# EAGLE design Looping Louie Motherboard (EAGLE 7.2.0)
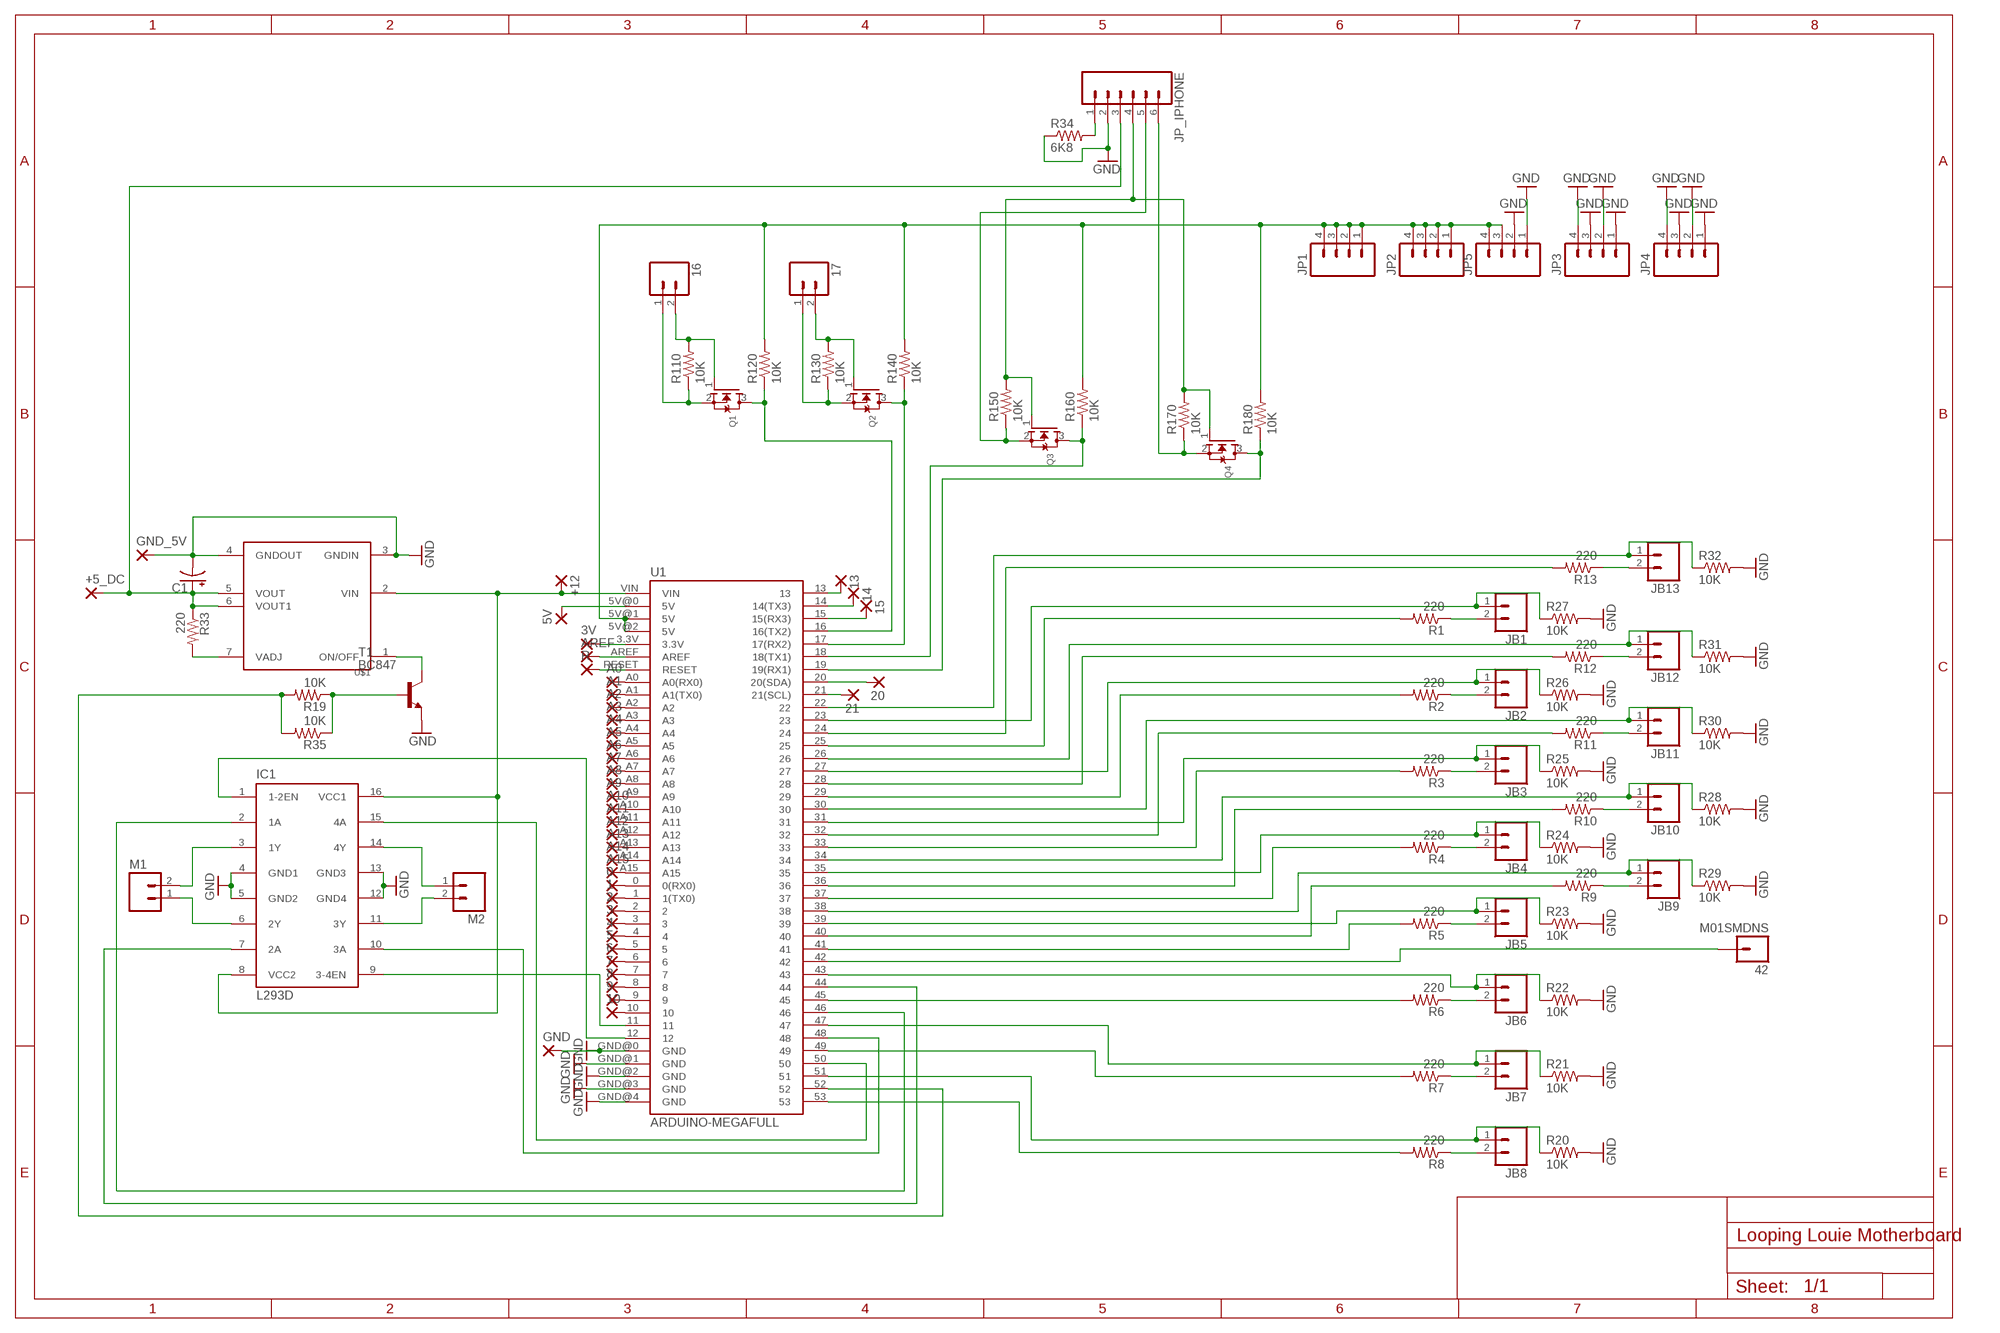
[diagram p0: schematic, sheet 1]

## Parts
0  1,6/0,8  [1,6/0,8]
1  1,6/0,8  [1,6/0,8]
2  1,6/0,8  [1,6/0,8]
3  1,6/0,8  [1,6/0,8]
3V  1,6/0,8  [1,6/0,8]
4  1,6/0,8  [1,6/0,8]
5  1,6/0,8  [1,6/0,8]
5V  1,6/0,8  [1,6/0,8]
6  1,6/0,8  [1,6/0,8]
7  1,6/0,8  [1,6/0,8]
8  1,6/0,8  [1,6/0,8]
9  1,6/0,8  [1,6/0,8]
10  1,6/0,8  [1,6/0,8]
13  1,6/0,8  [1,6/0,8]
14  1,6/0,8  [1,6/0,8]
15  1,6/0,8  [1,6/0,8]
16  M021X02_NO_SILK  [1X02_NO_SILK]
17  M021X02_NO_SILK  [1X02_NO_SILK]
20  1,6/0,8  [1,6/0,8]
21  1,6/0,8  [1,6/0,8]
42  M01SMDNS  [1X01NS]
+5_DC  3,81/1,4  [3,81/1,4]
+12  3,81/1,4  [3,81/1,4]
A0  1,6/0,8  [1,6/0,8]
A1  1,6/0,8  [1,6/0,8]
A2  1,6/0,8  [1,6/0,8]
A3  1,6/0,8  [1,6/0,8]
A4  1,6/0,8  [1,6/0,8]
A5  1,6/0,8  [1,6/0,8]
A6  1,6/0,8  [1,6/0,8]
A7  1,6/0,8  [1,6/0,8]
A8  1,6/0,8  [1,6/0,8]
A9  1,6/0,8  [1,6/0,8]
A10  1,6/0,8  [1,6/0,8]
A11  1,6/0,8  [1,6/0,8]
A12  1,6/0,8  [1,6/0,8]
A13  1,6/0,8  [1,6/0,8]
A14  1,6/0,8  [1,6/0,8]
A15  1,6/0,8  [1,6/0,8]
AREF  1,6/0,8  [1,6/0,8]
C1  CAP_POLG  [PANASONIC_G]
GND  3,81/1,4  [3,81/1,4]
GND_5V  3,81/1,4  [3,81/1,4]
IC1  L293D  [DIL16]
JB1  M021X02_NO_SILK  [1X02_NO_SILK]
JB2  M021X02_NO_SILK  [1X02_NO_SILK]
JB3  M021X02_NO_SILK  [1X02_NO_SILK]
JB4  M021X02_NO_SILK  [1X02_NO_SILK]
JB5  M021X02_NO_SILK  [1X02_NO_SILK]
JB6  M021X02_NO_SILK  [1X02_NO_SILK]
JB7  M021X02_NO_SILK  [1X02_NO_SILK]
JB8  M021X02_NO_SILK  [1X02_NO_SILK]
JB9  M021X02_NO_SILK  [1X02_NO_SILK]
JB10  M021X02_NO_SILK  [1X02_NO_SILK]
JB11  M021X02_NO_SILK  [1X02_NO_SILK]
JB12  M021X02_NO_SILK  [1X02_NO_SILK]
JB13  M021X02_NO_SILK  [1X02_NO_SILK]
JP1  M041X04_NO_SILK  [1X04_NO_SILK]
JP2  M041X04_NO_SILK  [1X04_NO_SILK]
JP3  M041X04_NO_SILK  [1X04_NO_SILK]
JP4  M041X04_NO_SILK  [1X04_NO_SILK]
JP5  M041X04_NO_SILK  [1X04_NO_SILK]
JP_IPHONE  M06LONGPADS  [1X06_LONGPADS]
M1  M02PTH3  [1X02_LONGPADS]
M2  M02PTH3  [1X02_LONGPADS]
Q1  MOSFET-NWAVE  [SOT23-W]
Q2  MOSFET-NWAVE  [SOT23-W]
Q3  MOSFET-NWAVE  [SOT23-W]
Q4  MOSFET-NWAVE  [SOT23-W]
R  1,6/0,8  [1,6/0,8]
R1  220  RESISTOR0603-RES  [0603-RES]
R2  220  RESISTOR0603-RES  [0603-RES]
R3  220  RESISTOR0603-RES  [0603-RES]
R4  220  RESISTOR0603-RES  [0603-RES]
R5  220  RESISTOR0603-RES  [0603-RES]
R6  220  RESISTOR0603-RES  [0603-RES]
R7  220  RESISTOR0603-RES  [0603-RES]
R8  220  RESISTOR0603-RES  [0603-RES]
R9  220  RESISTOR0603-RES  [0603-RES]
R10  220  RESISTOR0603-RES  [0603-RES]
R11  220  RESISTOR0603-RES  [0603-RES]
R12  220  RESISTOR0603-RES  [0603-RES]
R13  220  RESISTOR0603-RES  [0603-RES]
R19  10K  RESISTOR0603-RES  [0603-RES]
R20  10K  RESISTOR0603-RES  [0603-RES]
R21  10K  RESISTOR0603-RES  [0603-RES]
R22  10K  RESISTOR0603-RES  [0603-RES]
R23  10K  RESISTOR0603-RES  [0603-RES]
R24  10K  RESISTOR0603-RES  [0603-RES]
R25  10K  RESISTOR0603-RES  [0603-RES]
R26  10K  RESISTOR0603-RES  [0603-RES]
R27  10K  RESISTOR0603-RES  [0603-RES]
R28  10K  RESISTOR0603-RES  [0603-RES]
R29  10K  RESISTOR0603-RES  [0603-RES]
R30  10K  RESISTOR0603-RES  [0603-RES]
R31  10K  RESISTOR0603-RES  [0603-RES]
R32  10K  RESISTOR0603-RES  [0603-RES]
R33  220  RESISTOR0603-RES  [0603-RES]
R34  6K8  RESISTOR0603-RES  [0603-RES]
R35  10K  RESISTOR0603-RES  [0603-RES]
R110  10K  RESISTOR0603-RES  [0603-RES]
R120  10K  RESISTOR0603-RES  [0603-RES]
R130  10K  RESISTOR0603-RES  [0603-RES]
R140  10K  RESISTOR0603-RES  [0603-RES]
R150  10K  RESISTOR0603-RES  [0603-RES]
R160  10K  RESISTOR0603-RES  [0603-RES]
R170  10K  RESISTOR0603-RES  [0603-RES]
R180  10K  RESISTOR0603-RES  [0603-RES]
T1  BC847  [SOT23]
U1  ARDUINO-MEGAFULL  [ARDUINO_MEGA_MIRROR]
U$1  KIS-3R33S  [KIS-3R33S]

## Nets
3V3_IPHONE: JP_IPHONE.4 Q3.1(G) Q4.1(G) R150.2 R170.2
5V: JP1.1 JP1.2 JP1.3 JP1.4 JP2.1 JP2.2 JP2.3 JP2.4 JP5.3 JP5.4 R120.2 R140.2 R160.2 R180.2 U1.5V@1(5V) U1.5V@2(5V)
12V: +12.1(P) IC1.8(VCC2) IC1.16(VCC1) U1.VIN U$1.2(VIN)
+5V_DC: +5_DC.1(P) C1.+ JP_IPHONE.3 R33.1 U$1.5(VOUT) U$1.6(VOUT1)
GND: C1.- GND.1(P) GND_5V.1(P) IC1.4(GND1) IC1.5(GND2) IC1.12(GND4) IC1.13(GND3) JP3.1 JP3.2 JP3.3 JP3.4 JP4.1 JP4.2 JP4.3 JP4.4 JP5.1 JP5.2 JP_IPHONE.2 R20.2 R21.2 R22.2 R23.2 R24.2 R25.2 R26.2 R27.2 R28.2 R29.2 R30.2 R31.2 R32.2 R34.1 T1.2(E) U1.GND@0(GND) U1.GND@1(GND) U1.GND@2(GND) U1.GND@3(GND) U1.GND@4(GND) U$1.3(GNDIN) U$1.4(GNDOUT)
N$1: JB1.1 R27.1 U1.23
N$2: R1.2 U1.25
N$3: JB2.1 R26.1 U1.27
N$4: R2.2 U1.29
N$5: JB3.1 R25.1 U1.31
N$6: R3.2 U1.33
N$7: JB1.2 R1.1
N$8: JB2.2 R2.1
N$9: JB3.2 R3.1
N$10: R5.2 U1.41
N$11: JB4.1 R24.1 U1.35
N$12: JB5.1 R23.1 U1.39
N$13: JB4.2 R4.1
N$14: JB5.2 R5.1
N$15: JB6.2 R6.1
N$16: JB7.2 R7.1
N$17: JB8.2 R8.1
N$18: JB9.2 R9.1
N$19: JB10.2 R10.1
N$20: R8.2 U1.53
N$21: IC1.10(3A) U1.48
N$22: R6.2 U1.45
N$23: IC1.7(2A) U1.44
N$24: IC1.15(4A) U1.50
N$25: R7.2 U1.49
N$26: JB7.1 R21.1 U1.47
N$27: R4.2 U1.37
N$28: JB8.1 R20.1 U1.51
N$30: IC1.2(1A) U1.46
N$31: IC1.1(1-2EN) U1.12
N$32: Q4.3(D) R180.1 U1.19(19(RX1))
N$34: IC1.9(3-4EN) U1.11
N$36: JP_IPHONE.1 R34.2
N$37: 17.1 Q2.2(S) R130.1
N$38: Q2.3(D) R140.1 U1.17(17(RX2))
N$39: 17.2 Q2.1(G) R130.2
N$41: Q1.3(D) R120.1 U1.16(16(TX2))
N$42: 16.2 Q1.1(G) R110.2
N$43: R19.2 R35.2 U1.52
N$48: JB10.1 R28.1 U1.34
N$49: R11.2 U1.32
N$50: JB11.1 R30.1 U1.30
N$51: R12.2 U1.28
N$52: JB12.1 R31.1 U1.26
N$53: R13.2 U1.24
N$54: JB13.1 R32.1 U1.22
N$55: R19.1 R35.1 T1.1(B)
N$56: 16.1 Q1.2(S) R110.1
N$57: JB6.1 R22.1 U1.43
N$62: 5V.1(P) U1.5V@0(5V)
N$63: IC1.14(4Y) M2.1
N$64: IC1.11(3Y) M2.2
N$65: IC1.6(2Y) M1.1
N$66: IC1.3(1Y) M1.2
N$69: T1.3(C) U$1.1(ON/OFF)
N$72: R33.2 U$1.7(VADJ)
N$73: 0.1(P) U1.0(0(RX0))
N$74: 1.1(P) U1.1(1(TX0))
N$75: 2.1(P) U1.2
N$76: 3.1(P) U1.3
N$77: 4.1(P) U1.4
N$78: 5.1(P) U1.5
N$79: 6.1(P) U1.6
N$80: 7.1(P) U1.7
N$81: 8.1(P) U1.8
N$82: 9.1(P) U1.9
N$83: 10.1(P) U1.10
N$84: 3V.1(P) U1.3.3V
N$85: AREF.1(P) U1.AREF
N$86: R.1(P) U1.RESET
N$87: A0.1(P) U1.A0(A0(RX0))
N$88: A1.1(P) U1.A1(A1(TX0))
N$89: A2.1(P) U1.A2
N$90: A3.1(P) U1.A3
N$91: A4.1(P) U1.A4
N$92: A5.1(P) U1.A5
N$93: A6.1(P) U1.A6
N$94: A7.1(P) U1.A7
N$95: A8.1(P) U1.A8
N$96: A9.1(P) U1.A9
N$97: A10.1(P) U1.A10
N$98: A11.1(P) U1.A11
N$99: A12.1(P) U1.A12
N$100: A13.1(P) U1.A13
N$101: A14.1(P) U1.A14
N$102: A15.1(P) U1.A15
N$103: 13.1(P) U1.13
N$104: 14.1(P) U1.14(14(TX3))
N$105: 15.1(P) U1.15(15(RX3))
N$106: 20.1(P) U1.20(20(SDA))
N$107: 21.1(P) U1.21(21(SCL))
N$109: Q3.3(D) R160.1 U1.18(18(TX1))
N$111: R10.2 U1.36
N$117: JB9.1 R29.1 U1.38
N$118: R9.2 U1.40
N$119: 42.1 U1.42
N$122: JB13.2 R13.1
N$123: JB12.2 R12.1
N$124: JB11.2 R11.1
RX_IPHONE: JP_IPHONE.6 Q4.2(S) R170.1
TX_IPHONE: JP_IPHONE.5 Q3.2(S) R150.1

## Library data of the parts
0 1-3 3V 4 5 5V 6-10 13-15 20 21 A0 A1-A15 AREF R = wirepad:1,6/0,8: THROUGH-HOLE PAD
16 17 JB1-JB13 M1 M2 = SparkFun:M02: Header 2 Standard 2-pin 0.1" header. Use with straight break away headers (SKU : PRT-00116), right angle break away headers (PRT-00553), swiss pins (PRT-00743), machine pins (PRT-00117), and female headers (PRT-00115). Molex polarized connector foot print use with SKU : PRT-08233 with associated crimp pins and housings.
42 = SparkFun:M01: Header 1 Standard 1-pin 0.1" header. Use with straight break away headers (SKU : PRT-00116), right angle break away headers (PRT-00553), swiss pins (PRT-00743), machine pins (PRT-00117), and female headers (PRT-00115).
+5_DC +12 GND GND_5V = wirepad:3,81/1,4: THROUGH-HOLE PAD
C1 = SparkFun:CAP_POL: Capacitor Polarized These are standard SMD and PTH capacitors. Normally 10uF, 47uF, and 100uF in electrolytic and tantalum varieties. Always verify the external diameter of the through hole cap, it varies with capacity, voltage, and manufacturer. The EIA devices should be standard.
IC1 = st-microelectronics:L293D: PUSH-PULL 4 CHANNEL DRIVER; MPN: L293D; OC_FARNELL: 9589619; OC_NEWARK: 56P8249
JP1-JP5 = SparkFun:M04: Header 4 Standard 4-pin 0.1" header. Use with straight break away headers (SKU : PRT-00116), right angle break away headers (PRT-00553), swiss pins (PRT-00743), machine pins (PRT-00117), and female headers (PRT-00115). Molex polarized connector foot print use with SKU : PRT-08231 with associated crimp pins and housings. 1MM SMD Version SKU: PRT-10208
JP_IPHONE = SparkFun:M06: Header 6 Standard 6-pin 0.1" header. Use with straight break away headers (SKU : PRT-00116), right angle break away headers (PRT-00553), swiss pins (PRT-00743), machine pins (PRT-00117), and female headers (PRT-00115). Molex polarized connector foot print use with SKU : PRT-08094 with associated crimp pins and housings. NOTES ON THE VARIANTS LOCK and LOCK_LONGPADS... This footprint was designed to help hold the alignment of a through-hole component (i.e. 6-pin header) while soldering it into place. You may notice that each hole has been shifted either up or down by 0.005 of an inch from it's more standard position (which is a perfectly straight line). This slight alteration caused the pins (the squares in the middle) to touch the edges of the holes. Because they are alternating, it causes a "brace" to hold the component in place. 0.005 has proven to be the perfect amount of "off-center" position when using our standard breakaway headers. Although looks a little odd when you look at the bare footprint, once you have a header in there, the alteration is very hard to notice. Also, if you push a header all the way into place, it is covered up entirely on the bottom side. This idea of altering the position of holes to aid alignment will be further integrated into the Sparkfun Library for other footprints. It can help hold any component with 3 or more connection pins.
Q1-Q4 = adafruit:MOSFET-N: N-Channel Mosfet 2N7002E - 60V 260mA SOT23 [Digikey: 2N7002ET1GOSTR-ND] - REEL BSH103 - 30V 850mA SOT23 [Digikey: 568-5013-1-ND]
R1-R13 R19-R35 R110 R120 R130 R140 R150 R160 R170 R180 = SparkFun:RESISTOR: Resistor Basic schematic elements and footprints for 0603, 1206, and PTH resistors.
T1 = transistor:BC847: NPN TRANSISTOR
U1 = Arduino Mega mirror:ARDUINO-MEGA: Arduino Mega footprint connections
U$1 = Kis3r33s:KIS-3R33S: DC-DC Converter

## Board
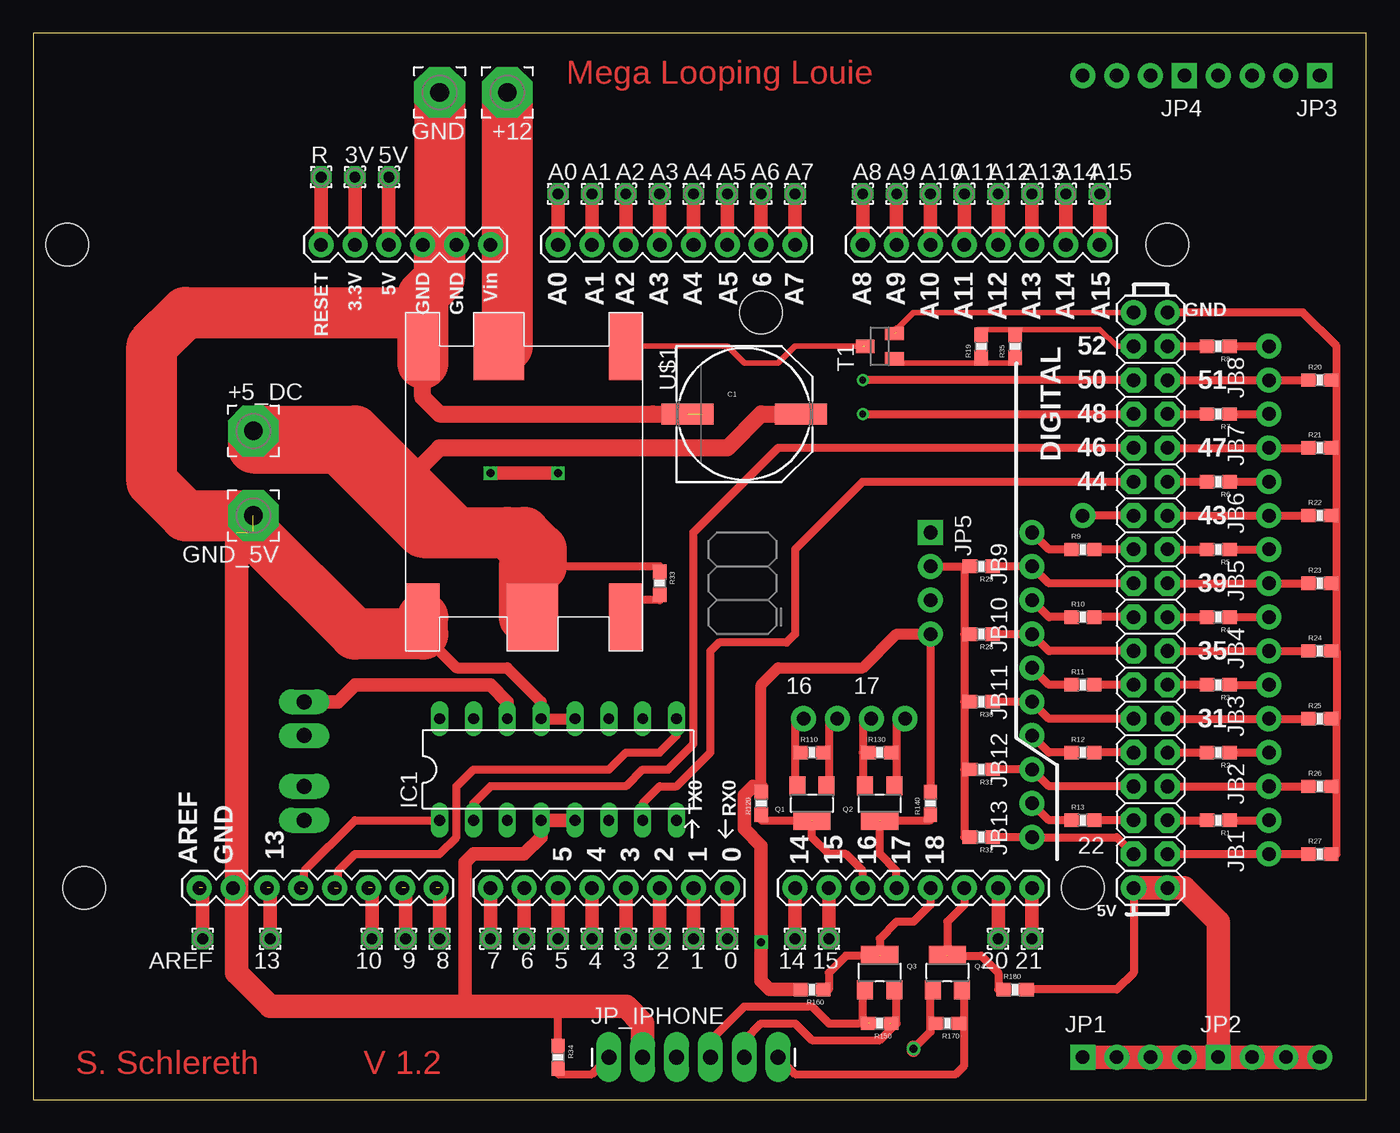
[diagram p1: board, top side]
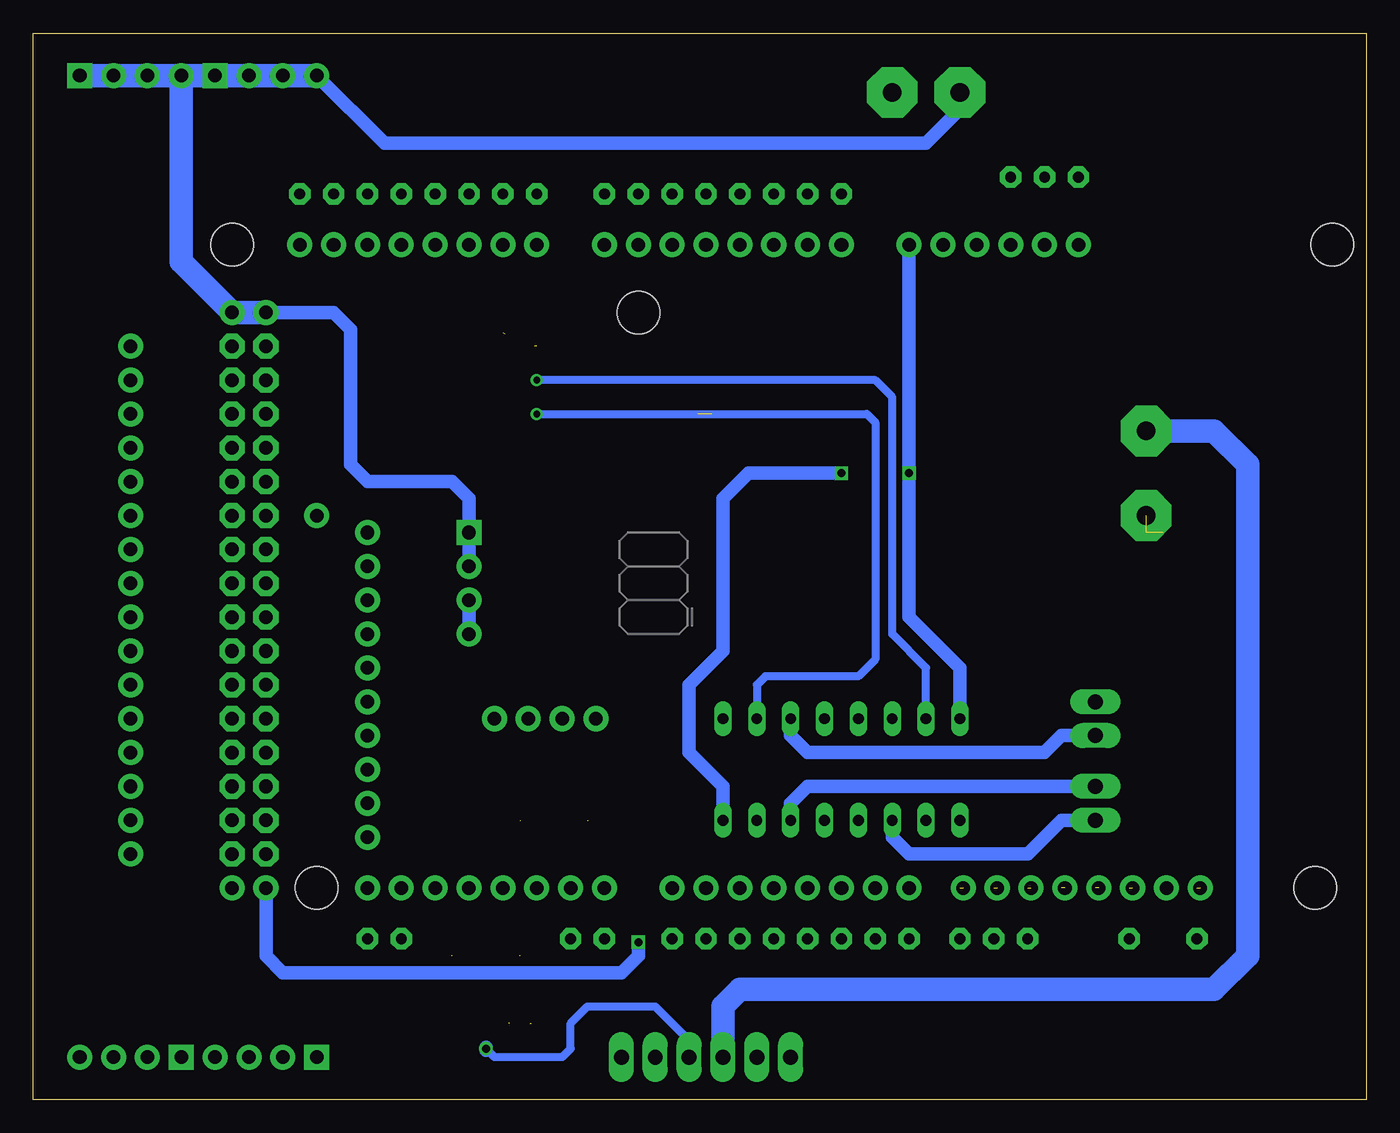
[diagram p2: board, bottom side, seen from below]

Size 100 x 80 mm. Coordinates in mm from the lower left corner, seen from the top.
Outline: 0,0 100,0 100,80 0,80 0,0
Copper layers (1*16): Top 0.035mm / dielectric 1.5mm / Bottom 0.035mm
Design rules "default *": minimum track width 10mil, minimum drill 24mil, track to track 8mil, track to pad 8mil, pad to pad 8mil, via to via 8mil, smd to smd 8mil, copper to edge 40mil, drill to drill 6mil, minimum pad ring 10mil, minimum via ring 8mil, stop-mask expansion 4mil, vias tented up to drill 0mil, thermal gap 10mil

### Footprints (pad centres in the part's own frame; a part is rotated, then mirrored left to right if it is on the bottom)
1,6/0,8 = drill 0.813 pad 1.6 octagon: 1 0,0
1X02_NO_SILK = drill 1.016 pad 1.88: 1 0,0; 2 2.54,0
1X01NS = drill 1.016 pad 1.88: 1 0,0
3,81/1,4 = drill 1.397 pad 3.81 octagon: 1 0,0
PANASONIC_G = smd 3.9 x 1.6: + 4.25,0; - -4.25,0
DIL16 = drill 0.813 long: 1 -8.89,-3.81; 2 -6.35,-3.81; 3 -3.81,-3.81; 4 -1.27,-3.81; 5 1.27,-3.81; 6 3.81,-3.81; 7 6.35,-3.81; 8 8.89,-3.81; 9 8.89,3.81; 10 6.35,3.81; 11 3.81,3.81; 12 1.27,3.81; 13 -1.27,3.81; 14 -3.81,3.81; 15 -6.35,3.81; 16 -8.89,3.81
1X04_NO_SILK = drill 1.016 pad 1.88 square: 1 0,0 | drill 1.016 pad 1.88: 2 2.54,0; 3 5.08,0; 4 7.62,0
1X06_LONGPADS = drill 1.118 pad 1.88 long: 1 0,0; 2 2.54,0; 3 5.08,0; 4 7.62,0; 5 10.16,0; 6 12.7,0
1X02_LONGPADS = drill 1.118 pad 1.88 long: 1 0,0; 2 2.54,0
SOT23-W = smd 1.2 x 1.4: 1 -1.1,-1.3; 2 1.1,-1.3 | smd 2.8 x 1.4: 3 0,1.3
0603-RES = smd 1.1 x 1: 1 -0.85,0; 2 0.85,0
SOT23 = smd 1 x 1.4: 1 -0.95,-1.1; 2 0.95,-1.1; 3 0,1.1
ARDUINO_MEGA_MIRROR = drill 1.016 pad 1.88: 0 -63.5,50.8; 1 -60.96,50.8; 2 -58.42,50.8; 3 -55.88,50.8; 3.3V -35.56,2.54; 4 -53.34,50.8; 5 -50.8,50.8; 5V@0 -38.1,2.54; 5V@1 -93.98,50.8; 5V@2 -96.52,50.8; 6 -48.26,50.8; 7 -45.72,50.8; 8 -41.656,50.8; 9 -39.116,50.8; 10 -36.576,50.8; 11 -34.036,50.8; 12 -31.496,50.8; 13 -28.956,50.8; 14 -68.58,50.8; 15 -71.12,50.8; 16 -73.66,50.8; 17 -76.2,50.8; 18 -78.74,50.8; 19 -81.28,50.8; 20 -83.82,50.8; 21 -86.36,50.8; A0 -50.8,2.54; A1 -53.34,2.54; A2 -55.88,2.54; A3 -58.42,2.54; A4 -60.96,2.54; A5 -63.5,2.54; A6 -66.04,2.54; A7 -68.58,2.54; A8 -73.66,2.54; A9 -76.2,2.54; A10 -78.74,2.54; A11 -81.28,2.54; A12 -83.82,2.54; A13 -86.36,2.54; A14 -88.9,2.54; A15 -91.44,2.54; AREF -23.876,50.8; GND@0 -40.64,2.54; GND@1 -43.18,2.54; GND@2 -93.98,7.62; GND@3 -96.52,7.62; GND@4 -26.416,50.8; RESET -33.02,2.54; VIN -45.72,2.54 | drill 1.016 pad 1.88 octagon: 22 -93.98,48.26; 23 -96.52,48.26; 24 -93.98,45.72; 25 -96.52,45.72; 26 -93.98,43.18; 27 -96.52,43.18; 28 -93.98,40.64; 29 -96.52,40.64; 30 -93.98,38.1; 31 -96.52,38.1; 32 -93.98,35.56; 33 -96.52,35.56; 34 -93.98,33.02; 35 -96.52,33.02; 36 -93.98,30.48; 37 -96.52,30.48; 38 -93.98,27.94; 39 -96.52,27.94; 40 -93.98,25.4; 41 -96.52,25.4; 42 -93.98,22.86; 43 -96.52,22.86; 44 -93.98,20.32; 45 -96.52,20.32; 46 -93.98,17.78; 47 -96.52,17.78; 48 -93.98,15.24; 49 -96.52,15.24; 50 -93.98,12.7; 51 -96.52,12.7; 52 -93.98,10.16; 53 -96.52,10.16 | hole 3.2: -15.24,50.8; -13.97,2.54; -66.04,7.62; -90.17,50.8; -96.52,2.54
KIS-3R33S = smd 5.08 x 2.54: 1 -10.16,7.62; 3 -10.16,-7.62; 4 10.16,-7.62; 5 10.16,0; 6 10.16,1.27; 7 10.16,7.62 | smd 5.08 x 3.81: 2 -10.16,-1.905

### Placement (x,y rotation side)
0  52.07,12.06 180 top
1  49.53,12.06 180 top
2  46.99,12.06 180 top
3  44.45,12.06 180 top
3V  24.13,69.22 0 top
4  41.91,12.06 180 top
5  39.37,12.06 180 top
5V  26.67,69.22 0 top
6  36.83,12.06 180 top
7  34.29,12.06 180 top
8  30.48,12.06 180 top
9  27.94,12.06 180 top
10  25.4,12.06 180 top
13  17.78,12.06 180 top
14  57.15,12.06 180 top
15  59.69,12.06 180 top
16  57.78,28.58 0 top
17  62.87,28.58 0 top
20  72.39,12.06 180 top
21  74.93,12.06 180 top
42  78.74,43.81 0 top
+5_DC  16.51,50.16 0 top
+12  35.56,75.57 180 top
A0  39.37,67.95 0 top
A1  41.91,67.95 0 top
A2  44.45,67.95 0 top
A3  46.99,67.95 0 top
A4  49.53,67.95 0 top
A5  52.07,67.95 0 top
A6  54.61,67.95 0 top
A7  57.15,67.95 0 top
A8  62.23,67.95 0 top
A9  64.77,67.95 0 top
A10  67.31,67.95 0 top
A11  69.85,67.95 0 top
A12  72.39,67.95 0 top
A13  74.93,67.95 0 top
A14  77.47,67.95 0 top
A15  80.01,67.95 0 top
AREF  12.7,12.06 180 top
C1  53.34,51.43 0 top
GND  30.48,75.57 180 top
GND_5V  16.51,43.81 180 top
IC1  39.37,24.77 0 top
JB1  92.71,18.42 90 top
JB2  92.71,23.5 90 top
JB3  92.71,28.58 90 top
JB4  92.71,33.66 90 top
JB5  92.71,38.73 90 top
JB6  92.71,43.81 90 top
JB7  92.71,48.89 90 top
JB8  92.71,53.98 90 top
JB9  74.93,40 90 top
JB10  74.93,34.92 90 top
JB11  74.93,29.85 90 top
JB12  74.93,24.77 90 top
JB13  74.93,19.69 90 top
JP1  78.74,3.17 0 top
JP2  88.9,3.17 0 top
JP3  96.52,76.84 180 top
JP4  86.36,76.84 180 top
JP5  67.31,42.54 270 top
JP_IPHONE  43.18,3.17 0 top
M1  20.32,23.5 270 top
M2  20.32,29.85 270 top
Q1  58.42,22.23 180 top
Q2  63.5,22.23 180 top
Q3  63.5,9.53 0 top
Q4  68.58,9.53 0 top
R  21.59,69.22 0 top
R1  88.9,20.96 180 top
R2  88.9,26.04 180 top
R3  88.9,31.12 180 top
R4  88.9,36.2 180 top
R5  88.9,41.27 180 top
R6  88.9,46.35 180 top
R7  88.9,51.43 180 top
R8  88.9,56.52 180 top
R9  78.74,41.27 0 top
R10  78.74,36.2 0 top
R11  78.74,31.12 0 top
R12  78.74,26.04 0 top
R13  78.74,20.96 0 top
R19  71.12,56.52 90 top
R20  96.52,53.98 0 top
R21  96.52,48.89 0 top
R22  96.52,43.81 0 top
R23  96.52,38.73 0 top
R24  96.52,33.66 0 top
R25  96.52,28.58 0 top
R26  96.52,23.5 0 top
R27  96.52,18.42 0 top
R28  71.12,34.92 180 top
R29  71.12,40 180 top
R30  71.12,29.85 180 top
R31  71.12,24.77 180 top
R32  71.12,19.69 180 top
R33  46.99,38.73 270 top
R34  39.37,3.17 270 top
R35  73.66,56.52 90 top
R110  58.42,26.04 0 top
R120  54.61,22.23 90 top
R130  63.5,26.04 0 top
R140  67.31,22.23 90 top
R150  63.5,5.71 180 top
R160  58.42,8.26 180 top
R170  68.58,5.71 180 top
R180  73.66,8.26 0 top
T1  63.5,56.52 90 top
U1  -11.43,66.68 180 top
U$1  36.83,46.35 270 top

### Tracks (layer width: path | path; a pad name or v marks a point on that pad's centre or on a via)
3V3_IPHONE  (via drill 0.6)  (1 unrouted)
  Top 0.61: JP_IPHONE.4 50.8,4.45 53.34,6.98 58.42,6.98 59.69,5.71 62.23,5.71 | 62.23,5.71 62.23,8.22 | 62.74,5.71 62.23,5.71 | v66.04,3.81 67.31,5.08 67.31,5.29 | 67.31,5.29 67.31,8.05 Q4.1 | 67.31,5.29 R170.2 | Q3.1 62.23,8.22 | 62.23,8.22 62.23,8.26
  Top 1.016: 66.04,3.68 v66.04,3.81 66.04,3.94
  Bottom 0.61: JP_IPHONE.4 50.8,4.45 53.34,6.98 58.42,6.98 59.69,5.71 59.69,3.81 60.33,3.17 65.41,3.17 v66.04,3.81
  Bottom 1.016: 66.04,3.68 v66.04,3.81 66.04,3.94
5V  (via drill 0.6 pad 0.81)
  Top 0.61: JP5.4 R140.2 | 54.36,23.5 53.98,23.5 | U1.5V@1 82.55,9.53 81.28,8.26 R180.2 | 54.61,23.5 R120.2 | R160.2 57.15,8.26
  Top 0.813: 54.61,23.5 54.61,31.12 55.88,32.38 62.23,32.38 64.77,34.92 JP5.4
  Top 1.016: 54.61,23.5 54.36,23.5 | 53.98,23.5 53.34,22.86 53.34,20.32 54.61,19.05 v54.61,11.81 54.61,8.89 55.24,8.26 57.15,8.26
  Top 1.778: U1.5V@1 U1.5V@2 86.36,15.88 88.9,13.33 JP2.1 JP2.2 JP2.3 JP2.4 JP1.4 JP1.3 JP1.2 JP1.1
  Bottom 1.016: JP5.4 JP5.3 | U1.5V@1 82.55,10.79 81.28,9.53 55.88,9.53 54.61,10.79 v54.61,11.81
12V  (via drill 0.6)
  Top 0.61: U$1.2 35.56,56.52
  Top 1.016: v34.29,46.99 v39.37,46.99
  Top 1.27: U1.VIN 34.29,57.15 U$1.2
  Top 3.81: +12.1 35.56,56.52
  Bottom 1.016: U1.VIN v34.29,46.99 34.29,36.2 30.48,32.38 IC1.16 | v39.37,46.99 46.35,46.99 48.26,45.09 48.26,33.66 50.8,31.12 50.8,26.04 48.26,23.5 IC1.8
+5V_DC
  Top 0.61: 38.1,40 46.99,40 R33.1
  Top 1.016: U$1.5 U$1.6
  Top 1.27: 27.94,46.35 30.48,48.89 52.07,48.89 54.61,51.43 C1.+
  Top 3.81: 31.75,42.54 27.94,46.35 24.13,50.16 +5_DC.1 16.51,48.89 22.86,48.89 29.21,42.54 31.75,42.54 | 31.75,42.54 35.56,42.54 | 35.56,42.54 36.83,41.27 | 35.56,42.54 36.83,42.54 38.1,41.27 38.1,40 36.83,40 U$1.5
  Bottom 1.778: JP_IPHONE.3 48.26,6.98 46.99,8.26 11.43,8.26 8.89,10.79 8.89,47.62 11.43,50.16 +5_DC.1
GND  (4 unrouted)
  Top 0.406: U1.GND@2 66.04,59.05 64.77,57.78
  Top 0.61: R34.1 39.37,6.98 | JP5.2 69.85,40 | 69.85,29.85 69.85,24.77 | 69.85,24.77 69.85,19.69 R32.2 | 97.79,33.66 97.79,28.58 | 64.77,57.53 64.77,57.78 | U1.GND@4 14.99,10.03 15.24,9.78 15.49,9.78 | 50.29,51.43 46.48,51.43 | R27.2 97.79,18.42 97.79,23.5 | R26.2 97.79,23.5 | 97.79,23.5 97.79,28.58 | 97.79,28.58 R25.2 | R24.2 97.79,33.66 | 97.79,33.66 97.79,38.73 | R23.2 97.79,38.73 | 97.79,38.73 97.79,43.81 | R22.2 97.79,43.81 | 97.79,43.81 97.79,48.89 | R21.2 97.79,48.89 | 97.79,48.89 97.79,53.98 | R20.2 97.79,53.98 | 97.79,53.98 97.79,56.52 95.25,59.05 U1.GND@3 | R29.2 69.85,40 | 69.85,40 69.85,34.92 | R28.2 69.85,34.92 | 69.85,34.92 69.85,29.85 | 69.85,29.85 R30.2 | R31.2 69.85,24.77
  Top 0.813: IC1.12 IC1.13 38.1,29.85 35.56,32.38 31.75,32.38 29.21,34.92
  Top 1.016: IC1.5 IC1.4 38.1,19.69 36.83,18.42 33.02,18.42 32.38,17.78 32.38,6.98
  Top 1.27: 50.16,51.43 46.48,51.43 30.48,51.43 29.21,52.7 29.21,55.24 U1.GND@0 U1.GND@1 31.75,63.5 30.48,62.23
  Top 1.778: JP_IPHONE.2 45.72,5.71 44.45,6.98 39.37,6.98 32.38,6.98 17.78,6.98 15.24,9.53 15.24,9.78 15.24,42.54
  Top 3.81: GND.1 30.48,62.23 30.48,61.59 29.21,60.32 29.21,59.05 | 29.21,59.05 U$1.3 29.21,55.24 | 16.51,42.54 24.13,34.92 29.21,34.92 U$1.4 | 29.21,59.05 11.43,59.05 8.89,56.52 8.89,46.35 11.43,43.81 GND_5V.1
  Bottom 1.016: U1.GND@2 77.47,59.05 76.2,57.78 76.2,47.62 74.93,46.35 68.58,46.35 67.31,45.09 JP5.1 JP5.2 | GND.1 30.48,74.3 33.02,71.76 73.66,71.76 JP4.4
  Bottom 1.778: U1.GND@2 U1.GND@3 88.9,62.86 JP3.4 | JP3.4 JP3.3 JP3.2 JP3.1 | JP4.4 JP4.3 JP4.2 JP4.1 | 87.63,76.84 JP4.1 | JP4.1 JP3.4
N$1
  Top 0.61: U1.23 JB1.1 R27.1
N$2
  Top 0.61: U1.25 R1.2
N$3
  Top 0.61: U1.27 JB2.1 R26.1
N$4
  Top 0.61: U1.29 R2.2
N$5
  Top 0.61: U1.31 JB3.1 R25.1
N$6
  Top 0.61: U1.33 R3.2 88.27,31.12
N$7
  Top 0.61: R1.1 JB1.2
N$8
  Top 0.61: R2.1 JB2.2
N$9
  Top 0.61: R3.1 JB3.2
N$10
  Top 0.61: U1.41 R5.2
N$11
  Top 0.61: U1.35 JB4.1 R24.1
N$12
  Top 0.61: U1.39 JB5.1 R23.1
N$13
  Top 0.61: R4.1 JB4.2
N$14
  Top 0.61: R5.1 JB5.2
N$15
  Top 0.61: R6.1 JB6.2
N$16
  Top 0.61: R7.1 JB7.2
N$17
  Top 0.61: R8.1 JB8.2
N$18
  Top 0.61: R9.1 76.2,41.27 JB9.2
N$19
  Top 0.61: R10.1 76.2,36.2 JB10.2
N$20
  Top 0.61: U1.53 R8.2
N$21  (via drill 0.5)
  Top 0.61: v62.23,51.43 U1.48
  Bottom 0.61: v62.23,51.43 37.47,51.43 36.83,50.8 36.83,33.02 38.1,31.75 45.09,31.75 45.72,31.12 IC1.10
N$22
  Top 0.61: U1.45 R6.2
N$23
  Top 0.61: IC1.7 45.72,22.23 46.99,23.5 48.26,23.5 50.8,26.04 50.8,33.66 51.44,34.29 56.52,34.29 57.15,34.92 57.15,41.27 62.23,46.35 U1.44
N$24  (via drill 0.5)
  Top 0.61: U1.50 v62.23,53.98
  Bottom 0.61: IC1.15 33.02,32.38 35.56,34.92 35.56,52.7 36.83,53.98 v62.23,53.98
N$25
  Top 0.61: U1.49 R7.2
N$26
  Top 0.61: U1.47 JB7.1 R21.1
N$27
  Top 0.61: U1.37 R4.2
N$28
  Top 0.61: U1.51 JB8.1 R20.1
N$30
  Top 0.61: IC1.2 33.02,22.23 34.29,23.5 44.45,23.5 45.72,24.77 47.62,24.77 49.53,26.67 49.53,42.54 49.85,42.86 55.88,48.89 U1.46
N$31  (1 unrouted)
  Top 0.61: 20.32,15.88 20.32,17.15 24.13,20.96 IC1.1
N$32  (1 unrouted)
  Top 0.61: U1.19 69.85,14.61 68.58,13.33 68.58,10.79 71.12,10.79 72.39,9.53 72.39,8.26 R180.1
N$34  (1 unrouted)
  Top 0.61: 22.86,15.88 22.86,17.15 24.13,18.42 30.48,18.42 31.75,19.69 31.75,23.5 33.02,24.77 43.18,24.77 44.45,26.04 46.99,26.04 48.26,27.31 IC1.9
N$36
  Top 0.61: JP_IPHONE.1 41.91,1.91 39.37,1.91 R34.2
N$37
  Top 0.61: 17.1 62.23,28.58 62.23,26.04 | R130.1 62.23,26.04 | 62.23,26.04 62.23,23.7 Q2.2
N$38  (1 unrouted)
  Top 0.61: U1.17 64.77,17.15 63.5,18.42 63.5,20.96 67.31,20.96 R140.1
N$39
  Top 0.61: 17.2 64.77,28.58 64.77,26.04 | R130.2 64.77,26.04 | 64.77,26.04 64.77,23.7 Q2.1
N$41  (1 unrouted)
  Top 0.61: U1.16 62.23,17.15 60.96,18.42 59.69,18.42 58.42,19.69 58.42,20.96 54.61,20.96 R120.1
N$42
  Top 0.61: 16.2 59.69,28.58 59.69,26.04 | R110.2 59.69,26.04 | 59.69,26.04 59.69,23.7 Q1.1
N$43
  Top 0.406: 73.66,57.78 80.01,57.78 81.28,56.52 U1.52 | 70.87,57.78 71.12,57.78 | R19.2 71.12,57.78 | 71.12,57.78 73.66,57.78 | 73.66,57.78 R35.2
N$48
  Top 0.61: R28.1 JB10.1 76.2,33.66 U1.34
N$49
  Top 0.61: U1.32 R11.2
N$50
  Top 0.61: U1.30 76.2,28.58 JB11.1 R30.1
N$51
  Top 0.61: U1.28 R12.2
N$52
  Top 0.61: U1.26 76.2,23.5 JB12.1 R31.1
N$53
  Top 0.61: U1.24 R13.2
N$54
  Top 0.61: R32.1 JB13.1 81.28,19.69 U1.22
N$55
  Top 0.406: R35.1 73.66,55.24 71.12,55.24 | R19.1 71.12,55.24 | 71.12,55.24 64.77,55.24 64.77,55.39 T1.1
N$56
  Top 0.61: 16.1 57.15,28.58 57.15,26.04 | R110.1 57.15,26.04 | 57.15,26.04 57.15,23.7 Q1.2
N$57
  Top 0.61: U1.43 JB6.1 R22.1
N$62
  Top 1.016: 26.67,64.39 5V.1 U1.5V@0
N$63
  Top 1.016: IC1.14 35.56,29.85 34.29,31.12 24.13,31.12 22.86,29.85 M2.1
N$64
  Bottom 1.016: IC1.11 43.18,27.31 41.91,26.04 24.13,26.04 22.86,27.31 M2.2
N$65
  Bottom 1.016: IC1.6 43.18,22.23 41.91,23.5 M1.1
N$66
  Bottom 1.016: IC1.3 35.56,19.69 34.29,18.42 25.4,18.42 22.86,20.96 M1.2
N$69  (1 unrouted)
  Top 0.406: 62.23,56.52 57.15,56.52 55.88,55.24 53.34,55.24 52.07,56.52 U$1.1
N$72
  Top 0.61: R33.2 46.99,37.46 44.45,37.46 U$1.7
N$73
  Top 1.016: U1.0 0.1
N$74
  Top 1.016: U1.1 1.1
N$75
  Top 1.016: U1.2 2.1
N$76
  Top 1.016: U1.3 3.1
N$77
  Top 1.016: U1.4 4.1
N$78
  Top 1.016: U1.5 5.1
N$79
  Top 1.016: U1.6 6.1
N$80
  Top 1.016: U1.7 7.1
N$81  (1 unrouted)
  Top 1.016: 30.48,15.88 8.1
N$82  (1 unrouted)
  Top 1.016: 27.94,15.88 9.1
N$83  (1 unrouted)
  Top 1.016: 25.4,15.88 10.1
N$84
  Top 1.016: 3V.1 U1.3.3V
N$85  (1 unrouted)
  Top 1.016: 12.7,15.88 AREF.1
N$86
  Top 1.016: U1.RESET R.1
N$87
  Top 1.016: A0.1 U1.A0
N$88
  Top 1.016: A1.1 U1.A1
N$89
  Top 1.016: A2.1 U1.A2
N$90
  Top 1.016: A3.1 U1.A3
N$91
  Top 1.016: A4.1 U1.A4
N$92
  Top 1.016: A5.1 U1.A5
N$93
  Top 1.016: A6.1 U1.A6
N$94
  Top 1.016: A7.1 U1.A7
N$95
  Top 1.016: A8.1 U1.A8
N$96
  Top 1.016: A9.1 U1.A9
N$97
  Top 1.016: A10.1 U1.A10
N$98
  Top 1.016: A11.1 U1.A11
N$99
  Top 1.016: A12.1 U1.A12
N$100
  Top 1.016: A13.1 U1.A13
N$101
  Top 1.016: A14.1 U1.A14
N$102
  Top 1.016: A15.1 U1.A15
N$103  (1 unrouted)
  Top 1.016: 17.78,15.88 13.1
N$104
  Top 1.016: U1.14 14.1
N$105
  Top 1.016: U1.15 15.1
N$106
  Top 1.016: U1.20 20.1
N$107
  Top 1.016: U1.21 21.1
N$109  (1 unrouted)
  Top 0.61: U1.18 67.31,14.61 66.04,13.33 64.77,13.33 63.5,12.06 63.5,10.79 60.96,10.79 59.69,9.53 59.69,8.26 R160.1
N$111
  Top 0.61: U1.36 R10.2
N$117
  Top 0.61: U1.38 76.2,38.73 JB9.1 R29.1
N$118
  Top 0.61: U1.40 R9.2
N$119
  Top 0.61: U1.42 42.1
N$122
  Top 0.61: R13.1 76.2,20.96 JB13.2
N$123
  Top 0.61: R12.1 76.2,26.04 JB12.2
N$124
  Top 0.61: R11.1 76.2,31.12 JB11.2
RX_IPHONE
  Top 0.61: R170.1 69.85,5.71 | 69.85,5.71 69.85,6.35 69.85,8.05 Q4.2 | JP_IPHONE.6 57.15,1.91 69.22,1.91 69.85,2.54 69.85,5.71
TX_IPHONE  (1 unrouted)
  Top 0.61: JP_IPHONE.5 53.34,4.45 54.61,5.71 57.15,5.71 58.42,4.45 63.5,4.45 64.77,5.71 | 64.77,5.71 64.77,8.22 | 64.26,5.71 64.77,5.71 | Q3.2 64.77,8.22 | 64.77,8.22 64.77,8.26

### Text on the board
Top: Mega Looping Louie | S. Schlereth | V 1.2